# Altium schematic sheet LED2.SchDoc
size A4
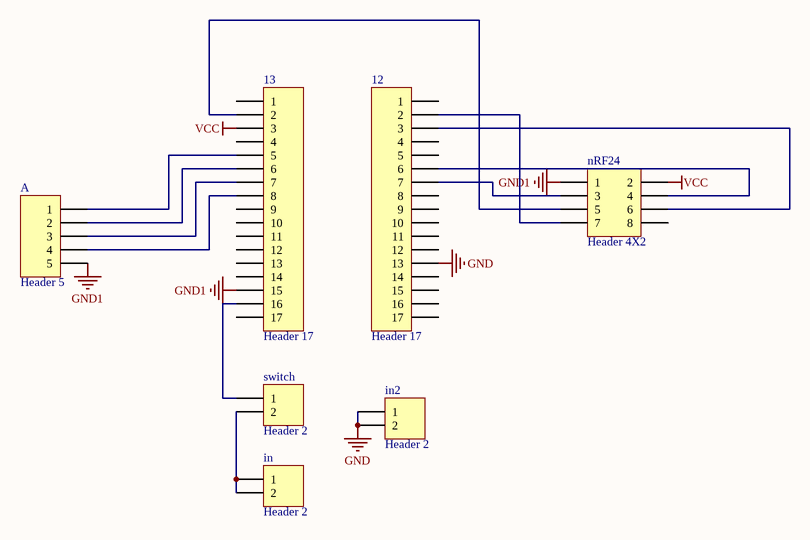
[diagram p0: LED2.SchDoc]

## Parts
12  Header 17  [HDR1X17]
13  Header 17  [HDR1X17]
A  Header 5  [HDR1X5]
in  Header 2  [HDR1X2]
in2  Header 2  [HDR1X2]
nRF24  Header 4X2  [HDR2X4]
switch  Header 2  [HDR1X2]

## Nets
GND: 12.13 in2.1 in2.2
GND1: 13.15 A.5 nRF24.1
VCC: 13.3 nRF24.2
Net12_2: 12.2 nRF24.7
Net12_3: 12.3 nRF24.6
Net12_6: 12.6 nRF24.4
Net12_7: 12.7 nRF24.3
Net13_2: 13.2 nRF24.5
Net13_5: 13.5 A.1
Net13_6: 13.6 A.2
Net13_7: 13.7 A.3
Net13_8: 13.8 A.4
Net13_16: 13.16 switch.1
Netin_1: in.1 in.2 switch.2

Not connected (* = marked no-connect by the designer): 12 1 4 5 8 9 10 11 12 14 15 16 17; 13 1 4 9 10 11 12 13 14 17; nRF24 8

## Library data of the parts
12 13 = Header 17: Header, 17-Pin; LatestRevisionDate: 17-Jul-2002; LatestRevisionNote: Re-released for DXP Platform.; Publisher: Altium Limited
A = Header 5: Header, 5-Pin; LatestRevisionDate: 17-Jul-2002; LatestRevisionNote: Re-released for DXP Platform.; Publisher: Altium Limited
in in2 switch = Header 2: Header, 2-Pin; LatestRevisionDate: 17-Jul-2002; LatestRevisionNote: Re-released for DXP Platform.; Publisher: Altium Limited
nRF24 = Header 4X2: Header, 4-Pin, Dual row; LatestRevisionDate: 17-Jul-2002; LatestRevisionNote: Re-released for DXP Platform.; Publisher: Altium Limited